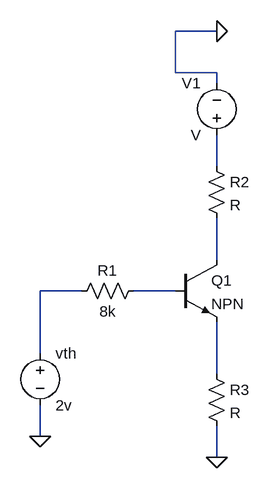
[diagram p0: schematic Draft2.asc]
Draft2.asc, the LTspice schematic file:
Version 4
SHEET 1 880 680
WIRE -704 -400 -768 -400
WIRE -768 -336 -768 -400
WIRE -704 -336 -768 -336
WIRE -704 -320 -704 -336
WIRE -704 -192 -704 -240
WIRE -704 -48 -704 -112
WIRE -912 0 -976 0
WIRE -768 0 -832 0
WIRE -976 96 -976 0
WIRE -704 128 -704 48
WIRE -976 224 -976 176
WIRE -704 256 -704 208
FLAG -976 224 0
FLAG -704 256 0
FLAG -704 -400 0
SYMBOL voltage -976 80 R0
WINDOW 123 0 0 Left 0
WINDOW 39 0 0 Left 0
SYMATTR InstName vth
SYMATTR Value 2v
SYMBOL res -816 -16 R90
WINDOW 0 0 56 VBottom 2
WINDOW 3 32 56 VTop 2
SYMATTR InstName R1
SYMATTR Value 8k
SYMBOL npn -768 -48 R0
SYMATTR InstName Q1
SYMBOL res -720 -208 R0
SYMATTR InstName R2
SYMBOL res -720 112 R0
SYMATTR InstName R3
SYMBOL voltage -704 -224 R180
WINDOW 0 24 96 Left 2
WINDOW 3 24 16 Left 2
SYMATTR InstName V1

The netlist it stands for:
* Draft2.asc
vth N003 0 2v
R1 N004 N003 8k
Q1 N002 N004 N005 0 NPN
R2 N001 N002 R
R3 N005 0 R
V1 N001 0 V
.model NPN NPN
.model PNP PNP
.lib standard.bjt
.backanno
.end